# Altium project stm32最小版.PrjPcb
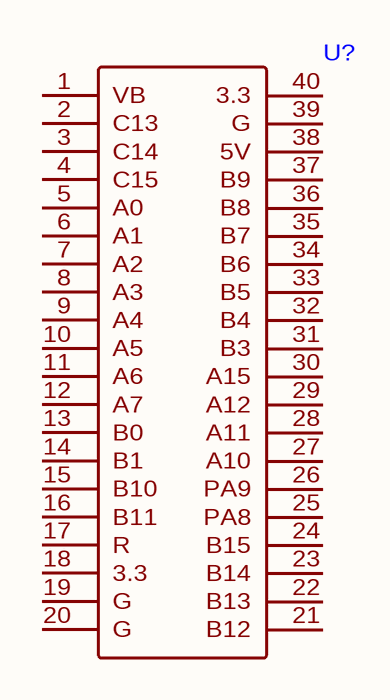
[diagram p0: STM32F103C8T6最小系统板_2020-09-12_10-41-42.schdoc]
1 sheet, 1 parts. Net scope: global (net labels, ports and power ports of the same name join across sheets).

## Sheet STM32F103C8T6最小系统板_2020-09-12_10-41-42.schdoc
size 57 x 75 mm

### Parts
U?  (no value)  [STM32F103C8T6核心板]

### Nets

Not connected (* = marked no-connect by the designer): U? 1(VB) 2(C13) 3(C14) 4(C15) 5(A0) 6(A1) 7(A2) 8(A3) 9(A4) 10(A5) 11(A6) 12(A7) 13(B0) 14(B1) 15(B10) 16(B11) 17(R) 18(3.3) 19(G) 20(G) 21(B12) 22(B13) 23(B14) 24(B15) 25(PA8) 26(PA9) 27(A10) 28(A11) 29(A12) 30(A15) 31(B3) 32(B4) 33(B5) 34(B6) 35(B7) 36(B8) 37(B9) 38(5V) 39(G) 40(3.3)

### Library data of the parts
U? = STM32F103C8T6最小系统板